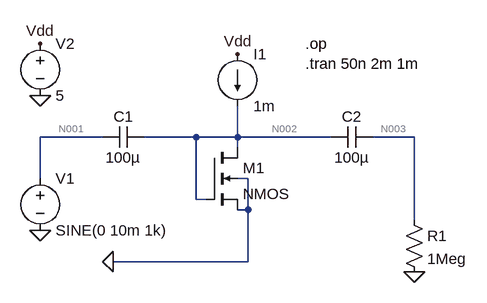
[diagram p0: schematic Draft1.asc]
Draft1.asc, the LTspice schematic file:
Version 4
SHEET 1 880 680
WIRE 48 208 -48 208
WIRE 192 208 112 208
WIRE 256 208 256 160
WIRE 256 208 192 208
WIRE 400 208 256 208
WIRE 528 208 464 208
WIRE 256 224 256 208
WIRE -48 272 -48 208
WIRE 272 272 256 272
WIRE 192 304 192 208
WIRE 208 304 192 304
WIRE 272 320 272 272
WIRE 272 320 256 320
WIRE 528 336 528 208
WIRE 272 400 272 320
WIRE 272 400 64 400
FLAG -48 144 0
FLAG -48 352 0
FLAG 64 400 0
FLAG -48 64 Vdd
FLAG 256 80 Vdd
FLAG 528 416 0
SYMBOL nmos4 208 224 R0
SYMATTR InstName M1
SYMBOL Cap 48 224 R270
WINDOW 0 32 32 VTop 2
WINDOW 3 0 32 VBottom 2
SYMATTR InstName C1
SYMATTR Value 100µ
SYMBOL Cap 400 192 M90
WINDOW 0 0 32 VBottom 2
WINDOW 3 32 32 VTop 2
SYMATTR InstName C2
SYMATTR Value 100µ
SYMBOL voltage -48 256 R0
SYMATTR InstName V1
SYMATTR Value SINE(0 10m 1k)
SYMBOL current 256 80 R0
SYMATTR InstName I1
SYMATTR Value 1m
SYMBOL voltage -48 48 R0
SYMATTR InstName V2
SYMATTR Value 5
SYMBOL Res 512 320 R0
SYMATTR InstName R1
SYMATTR Value 1Meg
TEXT 360 64 Left 2 !.op\n.tran 50n 2m 1m

The netlist it stands for:
* Draft1.asc
M1 N002 N002 0 0 NMOS
C1 N001 N002 100µ
C2 N002 N003 100µ
V1 N001 0 SINE(0 10m 1k)
I1 Vdd N002 1m
V2 Vdd 0 5
R1 N003 0 1Meg
.model NMOS NMOS
.model PMOS PMOS
.lib standard.mos
.op
.tran 50n 2m 1m
.backanno
.end

* Results of the author's LTspice run, read from the files saved beside the schematic
* Operating Point, zero values left out:
*   V(n002) = 1.342 V
*   V(vdd) = 5 V
*   Id(M1) = 1 mA
*   Ib(M1) = -1.352 pA
*   Is(M1) = -1 mA
*   I(I1) = 1 mA
*   I(V2) = -1 mA
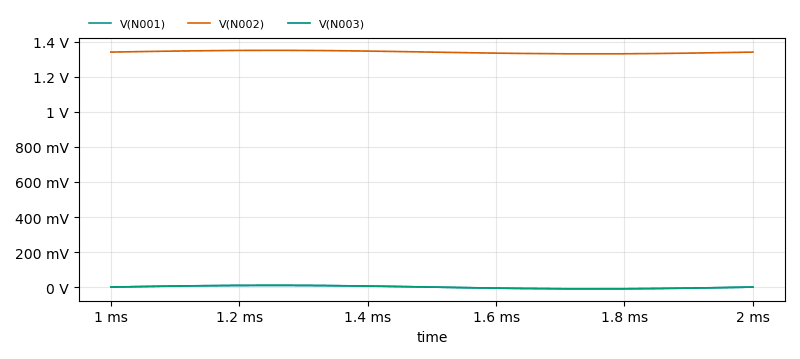
[diagram p1: Transient Analysis of Draft1.asc, plotted from the saved traces]
* Transient Analysis, 1 run:
*   V(N001): min -9.766 mV, max 9.932 mV, average 8.52 µV, rms 7.007 mV, last 0 V
*   V(N002): min 1.332 V, max 1.352 V, average 1.342 V, rms 1.342 V, last 1.342 V
*   V(N003): min -9.794 mV, max 9.905 mV, average -15.12 µV, rms 7.007 mV, last 151 nV